# Altium project PCB_Project_Lite.PrjPcb
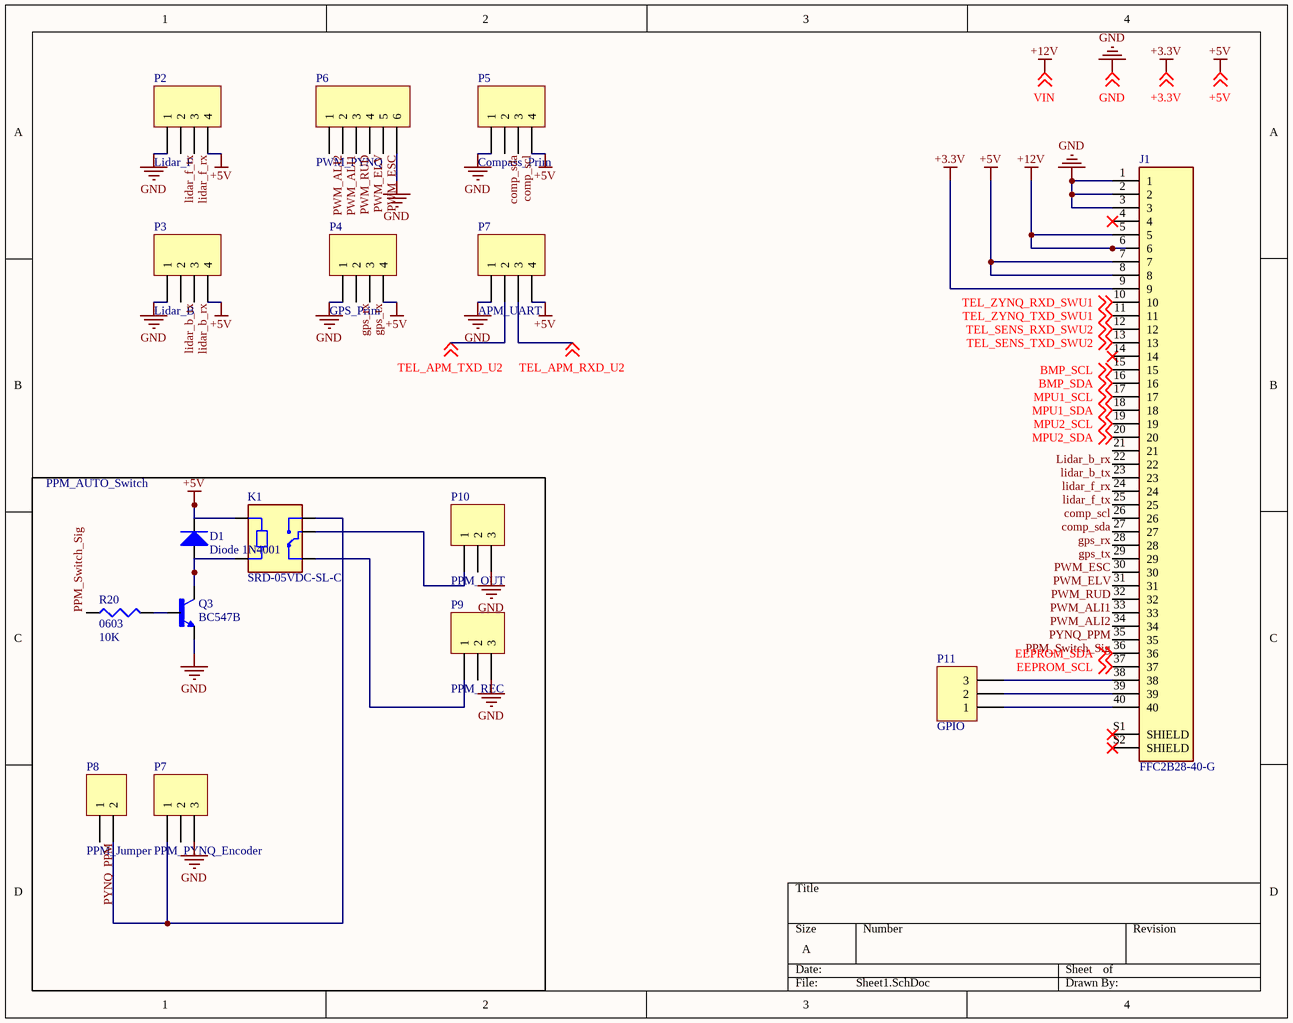
[diagram p0: Sheet1.SchDoc]
4 sheets, 39 parts. Net scope: global (net labels, ports and power ports of the same name join across sheets).
Board file: PCB1.PcbDoc
Sheets:
  Sheet1.SchDoc
  ESP32.SchDoc
  Sensors.SchDoc
  Voltage_Regulators.SchDoc

## Sheet Sheet1.SchDoc
size A

### Parts
(Parts that share a designator on the sheet are numbered #1, #2 ... from top to bottom, then left to right.)
D1  Diode 1N4001  [DO-41]
J1  FFC2B28-40-G  [GCT_FFC2B28-40-G]
K1  SRD-05VDC-SL-C  [RELAY_SRD-05VDC-SL-C]
P2  Lidar_F  [HDR1X4]
P3  Lidar_B  [HDR1X4]
P4  GPS_Prim  [HDR1X4]
P5  Compass_Prim  [HDR1X4]
P6  PWM_PYNQ  [HDR1X6]
P7#1  APM_UART  [HDR1X4]
P7#2  PPM_PYNQ_Encoder  [HDR1X3]
P8  PPM_Jumper  [HDR1X2]
P9  PPM_REC  [HDR1X3]
P10  PPM_OUT  [HDR1X3]
P11#1  GPIO  [HDR1X3]
Q3  BC547B  [TO92250P510H770-3]
R20  0603  value 10K  [J1-0603]

### Blocks framed on the sheet
PPM_AUTO_Switch: D1 K1 P7#2 P8-P10 Q3 R20

### Nets
+3.3V: J1.9 ; off-sheet +3.3V
+5V: D1.2(K) J1.7 J1.8 K1.A1 P2.4 P3.4 P4.4 P5.4 P7#1.4 ; off-sheet +5V
+12V: J1.5 J1.6 ; off-sheet VIN  [also labelled VIN]
GND: J1.1 J1.2 J1.3 P2.1 P3.1 P4.1 P5.1 P6.6 P7#1.1 P7#2.3 P9.3 P10.3 Q3.3(E) ; off-sheet GND
BMP_SCL: J1.15 ; off-sheet BMP_SCL
BMP_SDA: J1.16 ; off-sheet BMP_SDA
comp_scl: J1.25 P5.3
comp_sda: J1.26 P5.2
EEPROM_SCL: J1.37 ; off-sheet EEPROM_SCL
EEPROM_SDA: J1.36 ; off-sheet EEPROM_SDA
gps_rx: J1.27 P4.2
gps_tx: J1.28 P4.3
lidar_b_rx: J1.21 P3.3
lidar_b_tx: J1.22 P3.2
lidar_f_rx: J1.23 P2.3
lidar_f_tx: J1.24 P2.2
MPU1_SCL: J1.17 ; off-sheet MPU1_SCL
MPU1_SDA: J1.18 ; off-sheet MPU1_SDA
MPU2_SCL: J1.19 ; off-sheet MPU2_SCL
MPU2_SDA: J1.20 ; off-sheet MPU2_SDA
PPM_Switch_Sig: J1.35 R20.1
PWM_ALI1: J1.32 P6.2
PWM_ALI2: J1.33 P6.1
PWM_ELV: J1.30 P6.4
PWM_ESC: J1.29 P6.5
PWM_RUD: J1.31 P6.3
PYNQ_PPM: J1.34 P8.1
TEL_APM_RXD_U2: P7#1.3 ; off-sheet TEL_APM_RXD_U2
TEL_APM_TXD_U2: P7#1.2 ; off-sheet TEL_APM_TXD_U2
TEL_SENS_RXD_SWU2: J1.12 ; off-sheet TEL_SENS_RXD_SWU2
TEL_SENS_TXD_SWU2: J1.13 ; off-sheet TEL_SENS_TXD_SWU2
TEL_ZYNQ_RXD_SWU1: J1.10 ; off-sheet TEL_ZYNQ_RXD_SWU1
TEL_ZYNQ_TXD_SWU1: J1.11 ; off-sheet TEL_ZYNQ_TXD_SWU1
NetD1_1: D1.1(A) K1.A2 Q3.1(C)
NetJ1_38: J1.38 P11#1.3
NetJ1_39: J1.39 P11#1.2
NetJ1_40: J1.40 P11#1.1
NetK1_COM: K1.COM P10.1
NetK1_NC: K1.NC P9.1
NetK1_NO: K1.NO P7#2.1 P8.2
NetQ3_2: Q3.2(B) R20.2

Not connected (* = marked no-connect by the designer): J1 4* 14* S1(SHIELD)* S2(SHIELD)*; P7#2 2; P9 2; P10 2

### Library data of the parts
D1 = Diode 1N4001: 1 Amp General Purpose Rectifier; Published: 8-Jun-2000; LatestRevisionDate: 17-Jul-2002; LatestRevisionNote: Re-released for DXP Platform.; DatasheetVersion: 1998; PackageVersion: Aug-1999; PackageReference: DO-41; Publisher: Altium Limited; PackageDescription: Diode, Axial; Body 5.2 x 2.7 mm (LxDia. max), Lead Dia. 0.86 mm (max); Code_JEDEC: DO-204-AL; ComponentLink1Description: Manufacturer Link; ComponentLink1URL: http://www.fairchildsemi.com/; ComponentLink2Description: Datasheet; ComponentLink2URL: http://www.fairchildsemi.com/ds/1N%2F1N4001.pdf
J1 = FFC2B28-40-G: 40 Position FFC, FPC Connector Contacts, Top and Bottom 0.020 _0.50mm_ Surface Mount, Right Angle; MF: Global Connector Technology; Value: *; MP: FFC2B28-40-G; Package: Package Analog Devices; Price: None; Availability: Unavailable; SnapEDA_Link: https://www.snapeda.com/parts/FFC2B28-40-G/Global%20Connector%20Technology/view-part/4223068/?ref=snap
K1 = SRD-05VDC-SL-C: 5V Trigger Relay Module For Arduino And Raspberry Pi 5V Trigger Relay Module For Arduino And Raspberry Pi; Package: None; Availability: Unavailable; Value: *; MP: SRD-05VDC-SL-C; Price: None
P2-P5 P7#1 = Header 4: Header, 4-Pin; LatestRevisionDate: 17-Jul-2002; LatestRevisionNote: Re-released for DXP Platform.; Publisher: Altium Limited
P6 = Header 6: Header, 6-Pin; LatestRevisionDate: 17-Jul-2002; LatestRevisionNote: Re-released for DXP Platform.; Publisher: Altium Limited
P7#2 P9 P10 P11#1 = Header 3: Header, 3-Pin; LatestRevisionDate: 17-Jul-2002; LatestRevisionNote: Re-released for DXP Platform.; Publisher: Altium Limited
P8 = Header 2: Header, 2-Pin; LatestRevisionDate: 17-Jul-2002; LatestRevisionNote: Re-released for DXP Platform.; Publisher: Altium Limited
Q3 = BC547B: <a href="https://pricing.snapeda.com/parts/BC337-16%20A1/Taiwan%20Semiconductor/view-part?ref=eda">Check availability</a> <a href="https://pricing.snapeda.com/parts/BC337-16%20A1/Taiwan%20Semiconductor/view-part?ref=eda">Check availability</a>; Price: None; Value: *; Package: None; Availability: Unavailable; MP: BC547B
R20 = Res3: Resistor; Published: 8-Jun-2000; LatestRevisionDate: 29-May-2009; LatestRevisionNote: IPC-7351 Footprint Added.; PackageReference: J1-0603; Publisher: Altium Limited; PackageDescription: Chip Resistor

## Sheet ESP32.SchDoc
size A
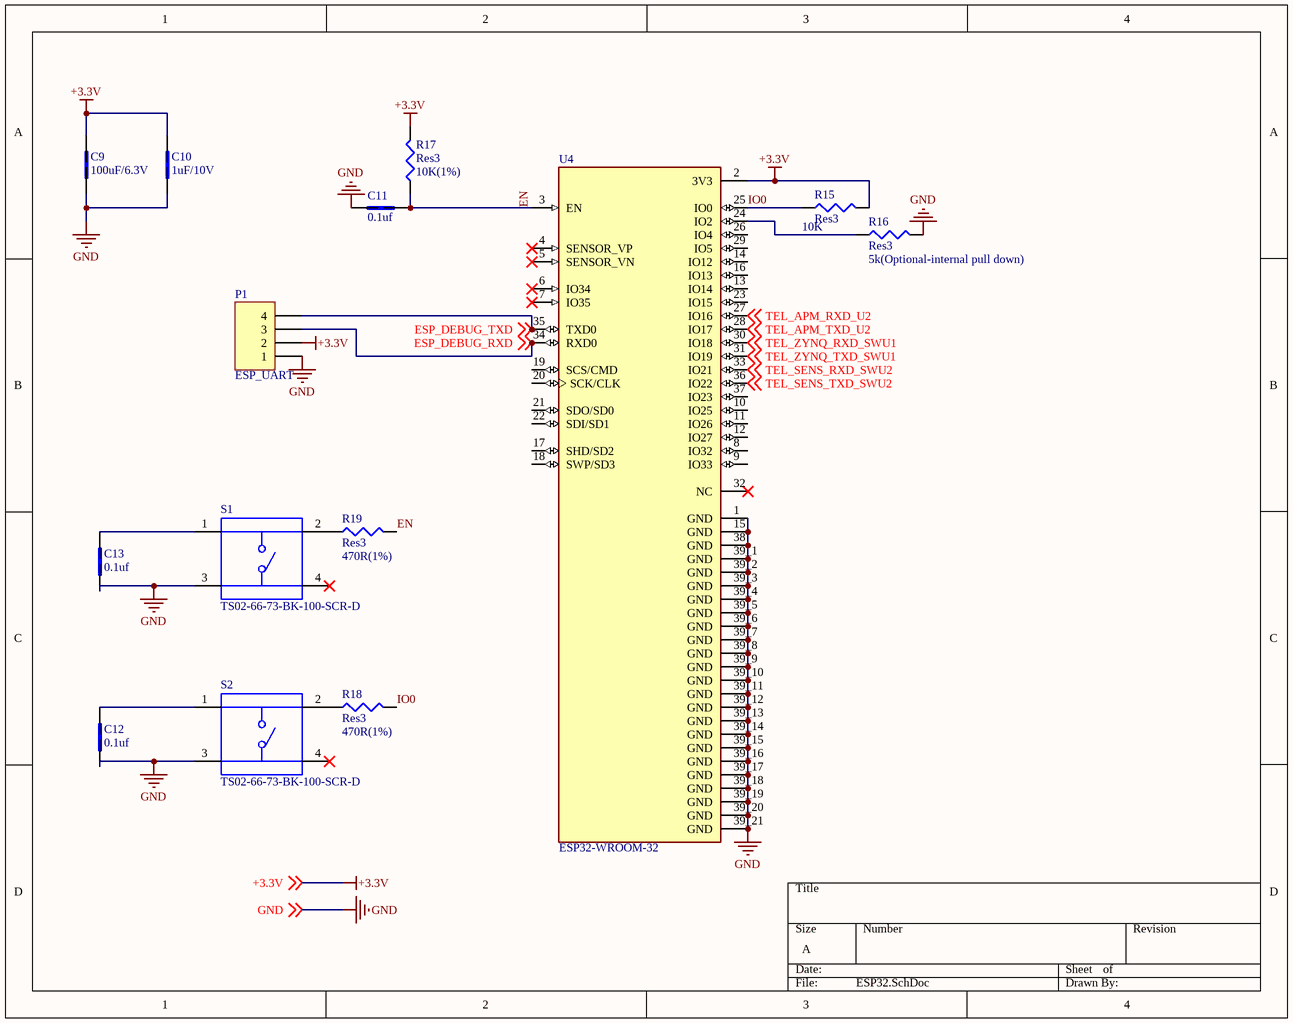
[diagram p1: ESP32.SchDoc]

### Parts
C9  100uF/6.3V  [CAPC1608X90]
C10  1uF/10V  [CAPC1608X90]
C11  0.1uf  [CAPC1608X90]
C12  0.1uf  [CAPC1608X90]
C13  0.1uf  [CAPC1608X90]
P1  ESP_UART  [HDR1X4]
R15  Res3  value 10K  [J1-0603]
R16  Res3  value 5k(Optional-internal pull down)  [J1-0603]
R17  Res3  value 10K(1%)  [J1-0603]
R18  Res3  value 470R(1%)  [J1-0603]
R19  Res3  value 470R(1%)  [J1-0603]
S1  TS02-66-73-BK-100-SCR-D  [SW_TS02-66-73-BK-100-SCR-D]
S2  TS02-66-73-BK-100-SCR-D  [SW_TS02-66-73-BK-100-SCR-D]
U4  ESP32-WROOM-32  [MODULE_ESP32-WROOM-32]

### Nets
+3.3V: C9.2 C10.2 P1.2 R15.2 R17.2 U4.2(3V3) ; off-sheet +3.3V
GND: C9.1 C10.1 C11.2 C12.2 C13.2 P1.1 R16.2 S1.3 S2.3 U4.1(GND) U4.15(GND) U4.38(GND) U4.39_1(GND) U4.39_2(GND) U4.39_3(GND) U4.39_4(GND) U4.39_5(GND) U4.39_6(GND) U4.39_7(GND) U4.39_8(GND) U4.39_9(GND) U4.39_10(GND) U4.39_11(GND) U4.39_12(GND) U4.39_13(GND) U4.39_14(GND) U4.39_15(GND) U4.39_16(GND) U4.39_17(GND) U4.39_18(GND) U4.39_19(GND) U4.39_20(GND) U4.39_21(GND) ; off-sheet GND
EN: C11.1 R17.1 R19.2 U4.3(EN)
ESP_DEBUG_RXD: P1.3 U4.34(RXD0) ; off-sheet ESP_DEBUG_RXD
ESP_DEBUG_TXD: P1.4 U4.35(TXD0) ; off-sheet ESP_DEBUG_TXD
IO0: R15.1 R18.2 U4.25(IO0)
TEL_APM_RXD_U2: U4.27(IO16) ; off-sheet TEL_APM_RXD_U2
TEL_APM_TXD_U2: U4.28(IO17) ; off-sheet TEL_APM_TXD_U2
TEL_SENS_RXD_SWU2: U4.33(IO21) ; off-sheet TEL_SENS_RXD_SWU2
TEL_SENS_TXD_SWU2: U4.36(IO22) ; off-sheet TEL_SENS_TXD_SWU2
TEL_ZYNQ_RXD_SWU1: U4.30(IO18) ; off-sheet TEL_ZYNQ_RXD_SWU1
TEL_ZYNQ_TXD_SWU1: U4.31(IO19) ; off-sheet TEL_ZYNQ_TXD_SWU1
NetC12_1: C12.1 S2.1
NetC13_1: C13.1 S1.1
NetR16_1: R16.1 U4.24(IO2)
NetR18_1: R18.1 S2.2
NetR19_1: R19.1 S1.2

Not connected (* = marked no-connect by the designer): S1 4*; S2 4*; U4 4(SENSOR_VP)* 5(SENSOR_VN)* 6(IO34)* 7(IO35)* 8(IO32) 9(IO33) 10(IO25) 11(IO26) 12(IO27) 13(IO14) 14(IO12) 16(IO13) 17(SHD/SD2) 18(SWP/SD3) 19(SCS/CMD) 20(SCK/CLK) 21(SDO/SD0) 22(SDI/SD1) 23(IO15) 26(IO4) 29(IO5) 32(NC)* 37(IO23)

### Library data of the parts
C9-C13 = C0603C104K5RACTU: 0.1ÂµF Â±10% 50V Ceramic Capacitor X7R 0603 (1608 Metric); MF: KEMET; SnapEDA_Link: https://www.snapeda.com/parts/C0603C104K5RACTU/KEMET/view-part/52584/?ref=snap; MP: C0603C104K5RACTU; Check_prices: https://www.snapeda.com/parts/C0603C104K5RACTU/KEMET/view-part/52584/?ref=eda; Digi-Key_Part_Number: 399-5089-1-ND; Value: *; Package: 0603 Kemet; Purchase-URL: https://pricing.snapeda.com/search/part/C0603C104K5RACTU/?ref=eda
P1 = Header 4: Header, 4-Pin; LatestRevisionDate: 17-Jul-2002; LatestRevisionNote: Re-released for DXP Platform.; Publisher: Altium Limited
R15-R19 = Res3: Resistor; Published: 8-Jun-2000; LatestRevisionDate: 29-May-2009; LatestRevisionNote: IPC-7351 Footprint Added.; PackageReference: J1-0603; Publisher: Altium Limited; PackageDescription: Chip Resistor
S1 S2 = TS02-66-73-BK-100-SCR-D: MF: {'manufacturer': u'CUI'}; Value: *; Package: None; Availability: Unavailable; MP: TS02-66-73-BK-100-SCR-D; Price: None
U4 = ESP32-WROOM-32: Package: None; MP: ESP32-WROOM-32; Value: *; Price: None; Availability: Unavailable

## Sheet Sensors.SchDoc
size A
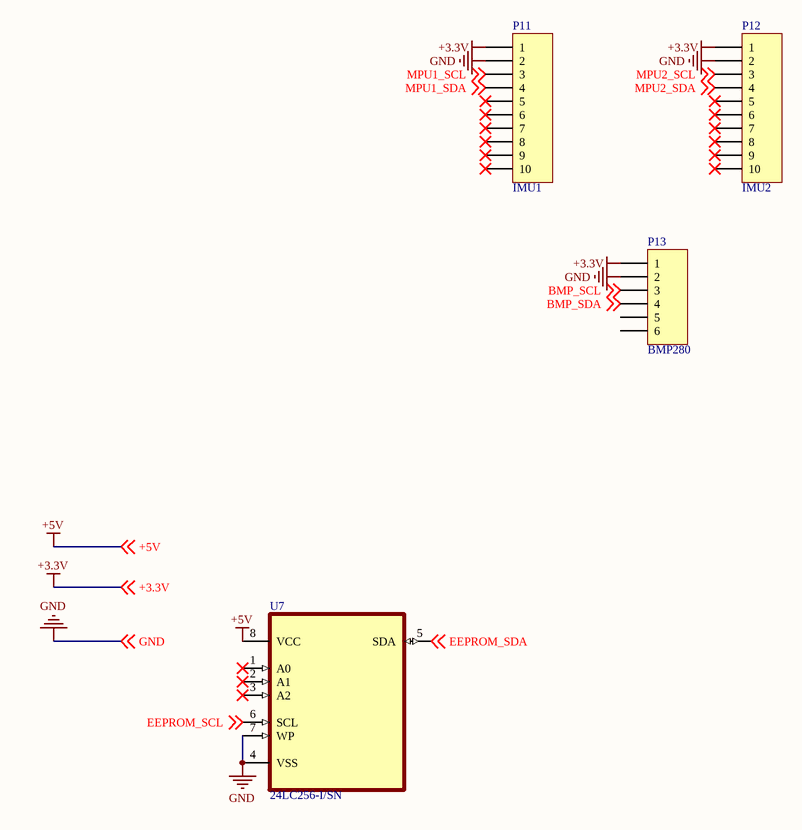
[diagram p2: Sensors.SchDoc]

### Parts
(Parts that share a designator on the sheet are numbered #1, #2 ... from top to bottom, then left to right.)
P11#2  IMU1  [HDR1X10]
P12  IMU2  [HDR1X10]
P13  BMP280  [HDR1X6]
U7  24LC256-I/SN  [SOIC127P600X175-8N]

### Nets
+3.3V: P11#2.1 P12.1 P13.1 ; off-sheet +3.3V
+5V: U7.8(VCC) ; off-sheet +5V
GND: P11#2.2 P12.2 P13.2 U7.4(VSS) U7.7(WP) ; off-sheet GND
BMP_SCL: P13.3 ; off-sheet BMP_SCL
BMP_SDA: P13.4 ; off-sheet BMP_SDA
EEPROM_SCL: U7.6(SCL) ; off-sheet EEPROM_SCL
EEPROM_SDA: U7.5(SDA) ; off-sheet EEPROM_SDA
MPU1_SCL: P11#2.3 ; off-sheet MPU1_SCL
MPU1_SDA: P11#2.4 ; off-sheet MPU1_SDA
MPU2_SCL: P12.3 ; off-sheet MPU2_SCL
MPU2_SDA: P12.4 ; off-sheet MPU2_SDA

Not connected (* = marked no-connect by the designer): P11#2 5* 6* 7* 8* 9* 10*; P12 5* 6* 7* 8* 9* 10*; P13 5 6; U7 1(A0)* 2(A1)* 3(A2)*

### Library data of the parts
P11#2 P12 = Header 10: Header, 10-Pin; LatestRevisionDate: 17-Jul-2002; LatestRevisionNote: Re-released for DXP Platform.; Publisher: Altium Limited
P13 = Header 6: Header, 6-Pin; LatestRevisionDate: 17-Jul-2002; LatestRevisionNote: Re-released for DXP Platform.; Publisher: Altium Limited
U7 = 24LC256-I/SN: EEPROM Memory IC 256Kb _32K x 8_ IÂ²C 400kHz 900ns 8-SOIC; MF: Microchip; Value: *; MP: 24LC256-I/SN; Package: SOIC-8 Microchip; SnapEDA_Link: https://www.snapeda.com/parts/24LC256-I/SN/Microchip/view-part/9771/?ref=snap; Price: None; Availability: Unavailable

## Sheet Voltage_Regulators.SchDoc
size A
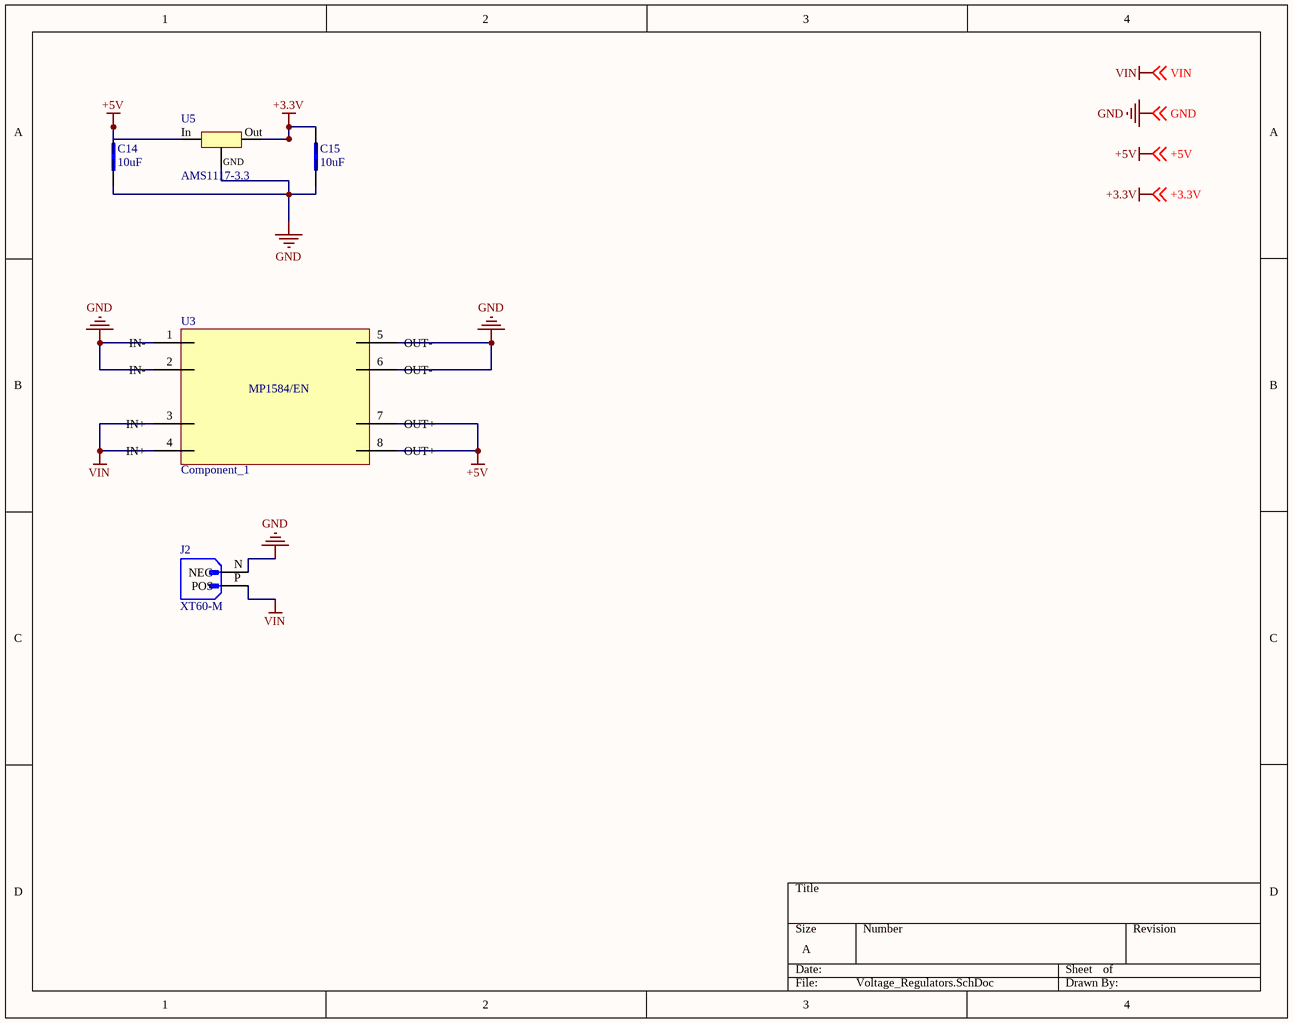
[diagram p3: Voltage_Regulators.SchDoc]

### Parts
C14  10uF  [CAPC1608X90]
C15  10uF  [CAPC1608X90]
J2  XT60-M  [AMASS_XT60-M]
U3  Component_1  [PCBComponent_1]
U5  AMS1117-3.3  [SOT223]

### Nets
+3.3V: C15.1 U5.2 ; off-sheet +3.3V
+5V: C14.1 U3.7(OUT+) U3.8(OUT+) U5.3 ; off-sheet +5V
GND: C14.2 C15.2 J2.N(NEG) U3.1(IN-) U3.2(IN-) U3.5(OUT-) U3.6(OUT-) U5.1 ; off-sheet GND
VIN: J2.P(POS) U3.3(IN+) U3.4(IN+) ; off-sheet VIN  [project net +12V]

### Notes on the sheet
- (in symbol AMS1117-3.3) In; Out; GND
- (in symbol Component_1) MP1584/EN

### Library data of the parts
C14 C15 = C0603C104K5RACTU: as C9 on sheet ESP32; SnapEDA_Link: https://www.snapeda.com/parts/C0603C104K5RACTU/KEMET/view-part/52584/?ref=snap; MP: C0603C104K5RACTU; Check_prices: https://www.snapeda.com/parts/C0603C104K5RACTU/KEMET/view-part/52584/?ref=eda; Digi-Key_Part_Number: 399-5089-1-ND; Value: *; Package: 0603 Kemet; Purchase-URL: https://pricing.snapeda.com/search/part/C0603C104K5RACTU/?ref=eda
J2 = XT60-M: Plug; DC supply; XT60; male; PIN: 2; for cable; soldered; 30A; 500V; MF: AMASS; Package: Package; Availability: Not in stock; SnapEDA_Link: https://www.snapeda.com/parts/XT60-M/AMASS/view-part/?ref=snap; Check_prices: https://www.snapeda.com/parts/XT60-M/AMASS/view-part/?ref=eda; MP: XT60-M; Price: None; Value: *

## Nets that join several sheets
+3.3V: Sheet1 (J1.9), ESP32 (6 pins), Sensors (P11#2.1 P12.1 P13.1), Voltage_Regulators (C15.1 U5.2)
+5V: Sheet1 (9 pins), Sensors (U7.8), Voltage_Regulators (C14.1 U3.7 U3.8 U5.3)
+12V: Sheet1 (J1.5 J1.6), Voltage_Regulators (J2.P U3.3 U3.4)
GND: Sheet1 (13 pins), ESP32 (33 pins), Sensors (5 pins), Voltage_Regulators (8 pins)
BMP_SCL: Sheet1 (J1.15), Sensors (P13.3)
BMP_SDA: Sheet1 (J1.16), Sensors (P13.4)
EEPROM_SCL: Sheet1 (J1.37), Sensors (U7.6)
EEPROM_SDA: Sheet1 (J1.36), Sensors (U7.5)
MPU1_SCL: Sheet1 (J1.17), Sensors (P11#2.3)
MPU1_SDA: Sheet1 (J1.18), Sensors (P11#2.4)
MPU2_SCL: Sheet1 (J1.19), Sensors (P12.3)
MPU2_SDA: Sheet1 (J1.20), Sensors (P12.4)
TEL_APM_RXD_U2: Sheet1 (P7#1.3), ESP32 (U4.27)
TEL_APM_TXD_U2: Sheet1 (P7#1.2), ESP32 (U4.28)
TEL_SENS_RXD_SWU2: Sheet1 (J1.12), ESP32 (U4.33)
TEL_SENS_TXD_SWU2: Sheet1 (J1.13), ESP32 (U4.36)
TEL_ZYNQ_RXD_SWU1: Sheet1 (J1.10), ESP32 (U4.30)
TEL_ZYNQ_TXD_SWU1: Sheet1 (J1.11), ESP32 (U4.31)